# EAGLE schematic STEVE (Mark II) (EAGLE 9.1.3)

## Sheet 1 of 3: Power
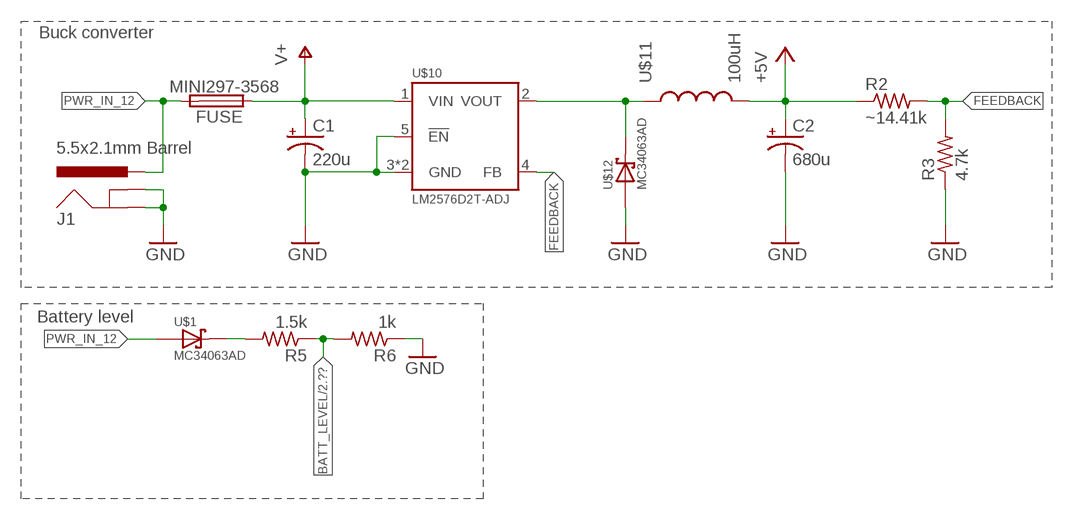
[diagram p0: schematic, sheet 1]

### Parts
C1  220u  CPOL-USUD-6,3X7,7  [UD-6,3X7,7_NICHICON]
C2  680u  CPOL-USUD-6,3X7,7  [UD-6,3X7,7_NICHICON]
FUSE  MINI297-3568  [3568]
J1  5.5x2.1mm Barrel  POWER_JACKSMD  [POWER_JACK_SMD]
R2  ~14.41k  R-US_R0603  [R0603]
R3  4.7k  R-US_R0603  [R0603]
R5  1.5k  R-US_R0603  [R0603]
R6  1k  R-US_R0603  [R0603]
U$1  MC34063AD  [SMC]
U$10  LM2576D2T-ADJ  [TO263-5]
U$11  100uH  INDUCTOR  [12MM_12MM_INDUCTOR]
U$12  MC34063AD  [SMC]

### Nets
+5V: C2.+ R2.1 U$11.P$2 ; also sheet 2,3
BATT_LEVEL: R5.1 R6.2 ; also sheet 2
FEEDBACK: R2.2 R3.2 U$10.4(FB)
GND: C1.- C2.- J1.GND(GNDBREAK) J1.P$4(GND) R3.1 R6.1 U$10.3(GND) U$10.5(!EN) U$10.6(GND) U$12.A ; also sheet 2,3
N$2: U$1.A
N$6: R5.2 U$1.C
N$8: U$10.2(VOUT) U$11.P$1 U$12.C
PWR_IN_12: FUSE.P$2 FUSE.P$3 J1.VIN0(PWR)
V+: C1.+ FUSE.P$1 FUSE.P$4 U$10.1(VIN)

### Notes on the sheet
- Buck converter
- Battery level

## Sheet 2 of 3: ATMEGA328p & LEDs
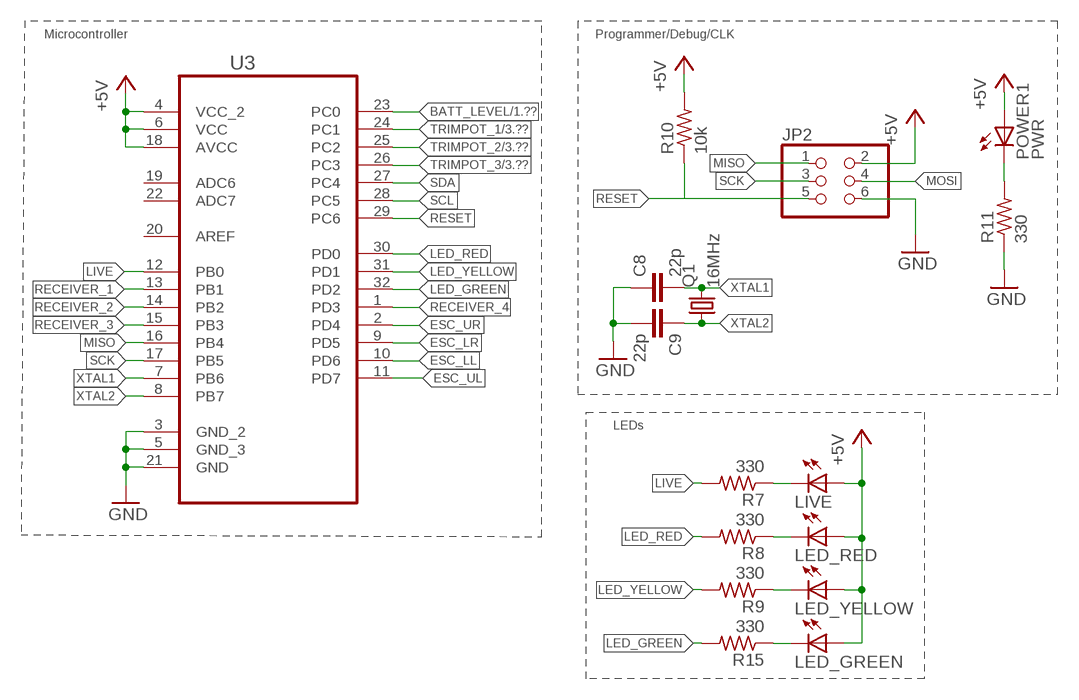
[diagram p1: schematic, sheet 2]

### Parts
C8  22p  C-EUC0805K  [C0805K]
C9  22p  C-EUC0805K  [C0805K]
JP2  PINHD-2X3  [2X03]
LED_GREEN  LEDSML0805  [SML0805]
LED_RED  LEDSML0805  [SML0805]
LED_YELLOW  LEDSML0805  [SML0805]
LIVE  LEDSML0805  [SML0805]
POWER1  PWR  LEDSML0805  [SML0805]
Q1  16MHz  CRYSTALCTS406  [CTS406]
R7  330  R-US_R0805  [R0805]
R8  330  R-US_R0805  [R0805]
R9  330  R-US_R0805  [R0805]
R10  10k  R-US_R0805  [R0805]
R11  330  R-US_R0805  [R0805]
R15  330  R-US_R0805  [R0805]
U3  ATMEGA328P-AU  [QFP80P900X900X120-32N]

### Nets
+5V: JP2.2 LED_GREEN.A LED_RED.A LED_YELLOW.A LIVE.A POWER1.A R10.2 U3.4(VCC_2) U3.6(VCC) U3.18(AVCC) ; also sheet 1,3
BATT_LEVEL: U3.23(PC0) ; also sheet 1
ESC_LL: U3.10(PD6)
ESC_LR: U3.9(PD5)
ESC_UL: U3.11(PD7)
ESC_UR: U3.2(PD4)
GND: C8.1 C9.2 JP2.6 R11.1 U3.3(GND_2) U3.5(GND_3) U3.21(GND) ; also sheet 1,3
LED_GREEN: R15.2 U3.32(PD2)
LED_RED: R8.2 U3.30(PD0)
LED_YELLOW: R9.2 U3.31(PD1)
LIVE: R7.2 U3.12(PB0)
MISO: JP2.1 U3.16(PB4)
MOSI: JP2.4
N$1: POWER1.C R11.2
N$3: LIVE.C R7.1
N$7: LED_RED.C R8.1
N$9: LED_YELLOW.C R9.1
N$10: LED_GREEN.C R15.1
RECEIVER_1: U3.13(PB1)
RECEIVER_2: U3.14(PB2)
RECEIVER_3: U3.15(PB3)
RECEIVER_4: U3.1(PD3)
RESET: JP2.5 R10.1 U3.29(PC6)
SCK: JP2.3 U3.17(PB5)
SCL: U3.28(PC5) ; also sheet 3
SDA: U3.27(PC4) ; also sheet 3
TRIMPOT_1: U3.24(PC1) ; also sheet 3
TRIMPOT_2: U3.25(PC2) ; also sheet 3
TRIMPOT_3: U3.26(PC3) ; also sheet 3
XTAL1: C8.2 Q1.3 U3.7(PB6)
XTAL2: C9.1 Q1.1 U3.8(PB7)
Unconnected: U3.19(ADC6) U3.20(AREF) U3.22(ADC7)

### Notes on the sheet
- Microcontroller | Programmer/Debug/CLK
- LEDs

## Sheet 3 of 3: MPU-6050 & PID Tuning
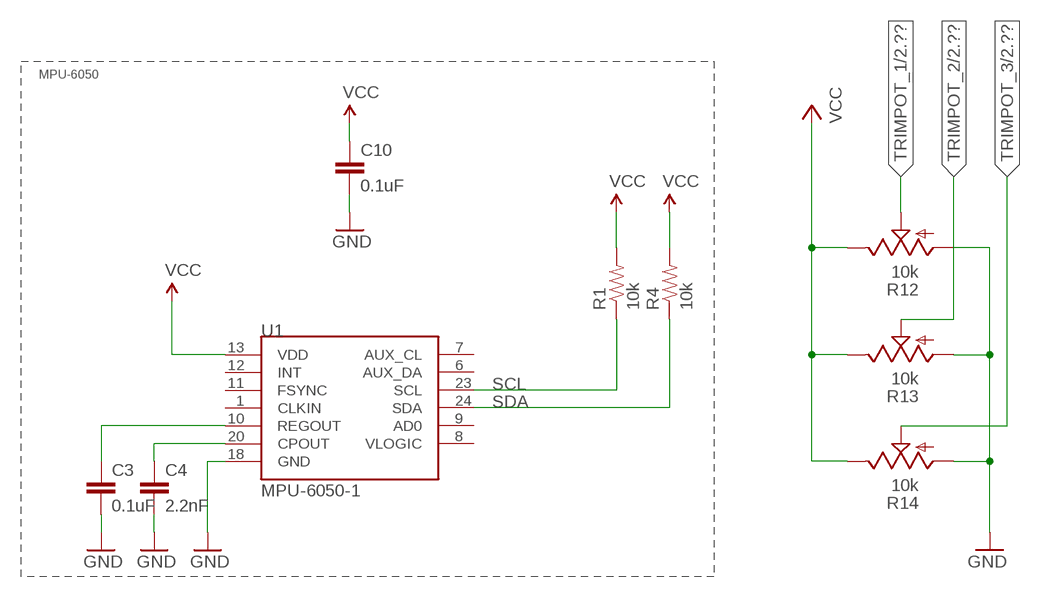
[diagram p2: schematic, sheet 3]

### Parts
C3  0.1uF  CAP0603-CAP  [0603-CAP]
C4  2.2nF  CAP0603-CAP  [0603-CAP]
C10  0.1uF  CAP0603-CAP  [0603-CAP]
R1  10k  RESISTOR0603-RES  [0603-RES]
R4  10k  RESISTOR0603-RES  [0603-RES]
R12  10k  TRIM_US-RJ9W  [RJ9W]
R13  10k  TRIM_US-RJ9W  [RJ9W]
R14  10k  TRIM_US-RJ9W  [RJ9W]
U1  MPU-6050-1  [QFN-24-4MM2]

### Nets
+5V: R12.E R13.E R14.E ; supply symbol labelled VCC ; also sheet 1,2
GND: C3.2 C4.2 C10.2 R12.A R13.A R14.A U1.18(GND) ; also sheet 1,2
N$4: C4.1 U1.20(CPOUT)
N$5: C3.1 U1.10(REGOUT)
SCL: R1.1 U1.23(SCL) ; also sheet 2
SDA: R4.1 U1.24(SDA) ; also sheet 2
TRIMPOT_1: R12.S ; also sheet 2
TRIMPOT_2: R13.S ; also sheet 2
TRIMPOT_3: R14.S ; also sheet 2
VCC: C10.1 R1.2 R4.2 U1.13(VDD)
Unconnected: U1.1(CLKIN) U1.6(AUX_DA) U1.7(AUX_CL) U1.8(VLOGIC) U1.9(AD0) U1.11(FSYNC) U1.12(INT)

### Notes on the sheet
- MPU-6050

## Library data of the parts
C1 C2 = rcl:CPOL-US: POLARIZED CAPACITOR, American symbol; SPICEPREFIX: C
C3 C4 C10 = SparkFun:CAP: Capacitor Standard 0603 ceramic capacitor, and 0.1" leaded capacitor.
C8 C9 = resistor:C-EU: CAPACITOR, European symbol
FUSE = Fuse:MINI297-3568
J1 = SparkFun-Connectors:POWER_JACK: Power Jack This is the standard 5.5mm barrel jack for power. The PTH is the most common, proven, reliable, footprint. The Slot footprint only works if the mill layer is transmitted to the PCB fab house so be warned. Mating wall wart : TOL-00298 (and others); PROD_ID: CONN-08106; SF_ID: PRT-12748
JP2 = pinhead:PINHD-2X3: PIN HEADER
LED_GREEN LED_RED LED_YELLOW LIVE POWER1 = led:LED: LED OSRAM: - CHIPLED LG R971, LG N971, LY N971, LG Q971, LY Q971, LO R971, LY R971 LH N974, LH R974 LS Q976, LO Q976, LY Q976 LO Q996 - Hyper CHIPLED LW Q18S LB Q993, LB Q99A, LB R99A - SideLED LS A670, LO A670, LY A670, LG A670, LP A670 LB A673, LV A673, LT A673, LW A673 LH A674 LY A675 LS A676, LA A676, LO A676, LY A676, LW A676 LS A679, LY A679, LG A679 - Hyper Micro SIDELED® LS Y876, LA Y876, LO Y876, LY Y876 LT Y87S - SmartLED LW L88C, LW L88S LB L89C, LB L89S, LG L890 LS L89K, LO L89K, LY L89K LS L896, LA L896, LO L896, LY L896 - TOPLED LS T670, LO T670, LY T670, LG T670, LP T670 LSG T670, LSP T670, LSY T670, LOP T670, LYG T670 LG T671, LOG T671, LSG T671 LB T673, LV T673, LT T673, LW T673 LH T674 LS T676, LA T676, LO T676, LY T676, LB T676, LH T676, LSB T676, LW T676 LB T67C, LV T67C, LT T67C, LS T67K, LO T67K, LY T67K, LW E67C LS E67B, LA E67B, LO E67B, LY E67B, LB E67C, LV E67C, LT E67C LW T67C LS T679, LY T679, LG T679 LS T770, LO T770, LY T770, LG T770, LP T770 LB T773, LV T773, LT T773, LW T773 LH T774 LS E675, LA E675, LY E675, LS T675 LS T776, LA T776, LO T776, LY T776, LB T776 LHGB T686 LT T68C, LB T68C - Hyper Mini TOPLED® LB M676 - Mini TOPLED Santana® LG M470 LS M47K, LO M47K, LY M47K Source: http://www.osram.convergy.de LUXEON: - LUMILED® LXK2-PW12-R00, LXK2-PW12-S00, LXK2-PW14-U00, LXK2-PW14-V00 LXK2-PM12-R00, LXK2-PM12-S00, LXK2-PM14-U00 LXK2-PE12-Q00, LXK2-PE12-R00, LXK2-PE12-S00, LXK2-PE14-T00, LXK2-PE14-U00 LXK2-PB12-K00, LXK2-PB12-L00, LXK2-PB12-M00, LXK2-PB14-N00, LXK2-PB14-P00, LXK2-PB14-Q00 LXK2-PR12-L00, LXK2-PR12-M00, LXK2-PR14-Q00, LXK2-PR14-R00 LXK2-PD12-Q00, LXK2-PD12-R00, LXK2-PD12-S00 LXK2-PH12-R00, LXK2-PH12-S00 LXK2-PL12-P00, LXK2-PL12-Q00, LXK2-PL12-R00 Source: www.luxeon.com KINGBRIGHT: KA-3528ASYC Source: www.kingbright.com
Q1 = adafruit:CRYSTAL: CRYSTAL; OC_FARNELL: unknown; OC_NEWARK: unknown
R1 R4 = SparkFun:RESISTOR: Resistor Basic schematic elements and footprints for 0603, 1206, and PTH resistors.
R2 R3 R5 R6 = rcl:R-US_: RESISTOR, American symbol; SPICEPREFIX: R
R7-R11 R15 = rcl:R-US_: RESISTOR, American symbol
R12-R14 = pot:TRIM_US-: POTENTIOMETER
U1 = Testing:MPU-6050
U3 = Atmel_By_element14_Batch_1-00:ATMEGA328P-AU: 8-bit Microcontroller with In-System Programmable Flash; MPN: ATMEGA328P-AU; OC_FARNELL: 1715486; OC_NEWARK: 14R4631; PACKAGE: TQFP-32; SUPPLIER: Atmel
U$1 U$12 = Display_Custom:MC34063AD: MC34063AD https://www.fairchildsemi.com/datasheets/MB/MBRS320.pdf 3 watt, 3A, fV 500mV, 20v rV
U$10 = Display_Custom:LM2576D2T-ADJ: LM2576D2T-ADJ Adjustable Buck Voltage Regulator http://www.onsemi.com/pub/Collateral/LM2576-D.PDF
U$11 = Display_Custom:INDUCTOR

## Net classes
0 default: width 0.152 mm, drill 0.305 mm, clearance 0.152 mm